# Altium schematic sheet 升压模块原理图.SchDoc
size A
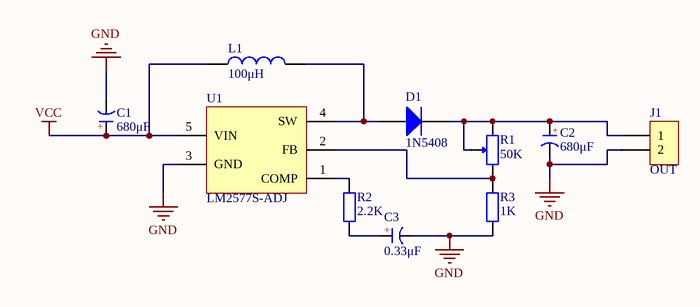
[diagram p0: 升压模块原理图.SchDoc]

## Parts
C1  680μF
C2  680μF
C3  0.33μF
D1  1N5408  [DO-201AD]
J1  OUT  [2PIN杜邦插座_1.27mm]
L1  100μH
R1  50K
R2  2.2K
R3  1K
U1  LM2577S-ADJ

## Nets
GND: C1.2(K) C2.2(K) C3.2(K) J1.2 R3.1 U1.3(GND)
VCC: C1.1(A) L1.1 U1.5(VIN)
NetC2_1: C2.1(A) D1.2(K) J1.1 R1.2 R1.3
NetC3_1: C3.1(A) R2.1
NetD1_1: D1.1(A) L1.2 U1.4(SW)
NetR1_1: R1.1 R3.2 U1.2(FB)
NetR2_2: R2.2 U1.1(COMP)

## Notes on the sheet
- (in symbol 极性电容) +

## Library data of the parts
C1-C3 = 极性电容
D1 = Diode 1N5408: 3 Amp Medium Power Silicon Rectifier Diode; Published: 8-Jun-2000; LatestRevisionDate: 17-Jul-2002; LatestRevisionNote: Re-released for DXP Platform.; DatasheetVersion: Aug-1984; PackageReference: DO-201AD; Publisher: Altium Limited; PackageDescription: Diode, Axial; Body 9.5 x 5.3 mm (LxDia. max), Lead Dia. 1.32 mm (max); ComponentLink1Description: Manufacturer Link; ComponentLink1URL: http://www.irf.com/
J1 = CON2: Connector
L1 = 电感
R1 = 电位器
R2 R3 = 电阻